# Altium schematic sheet PSU.SchDoc
size 420 x 297 mm; Address1: Address1; Address2: Address2; Address3: Address3; Address4: Address4; SheetNumber: 2; SheetTotal: 2; DocumentType: Схема электрическая принципиальная
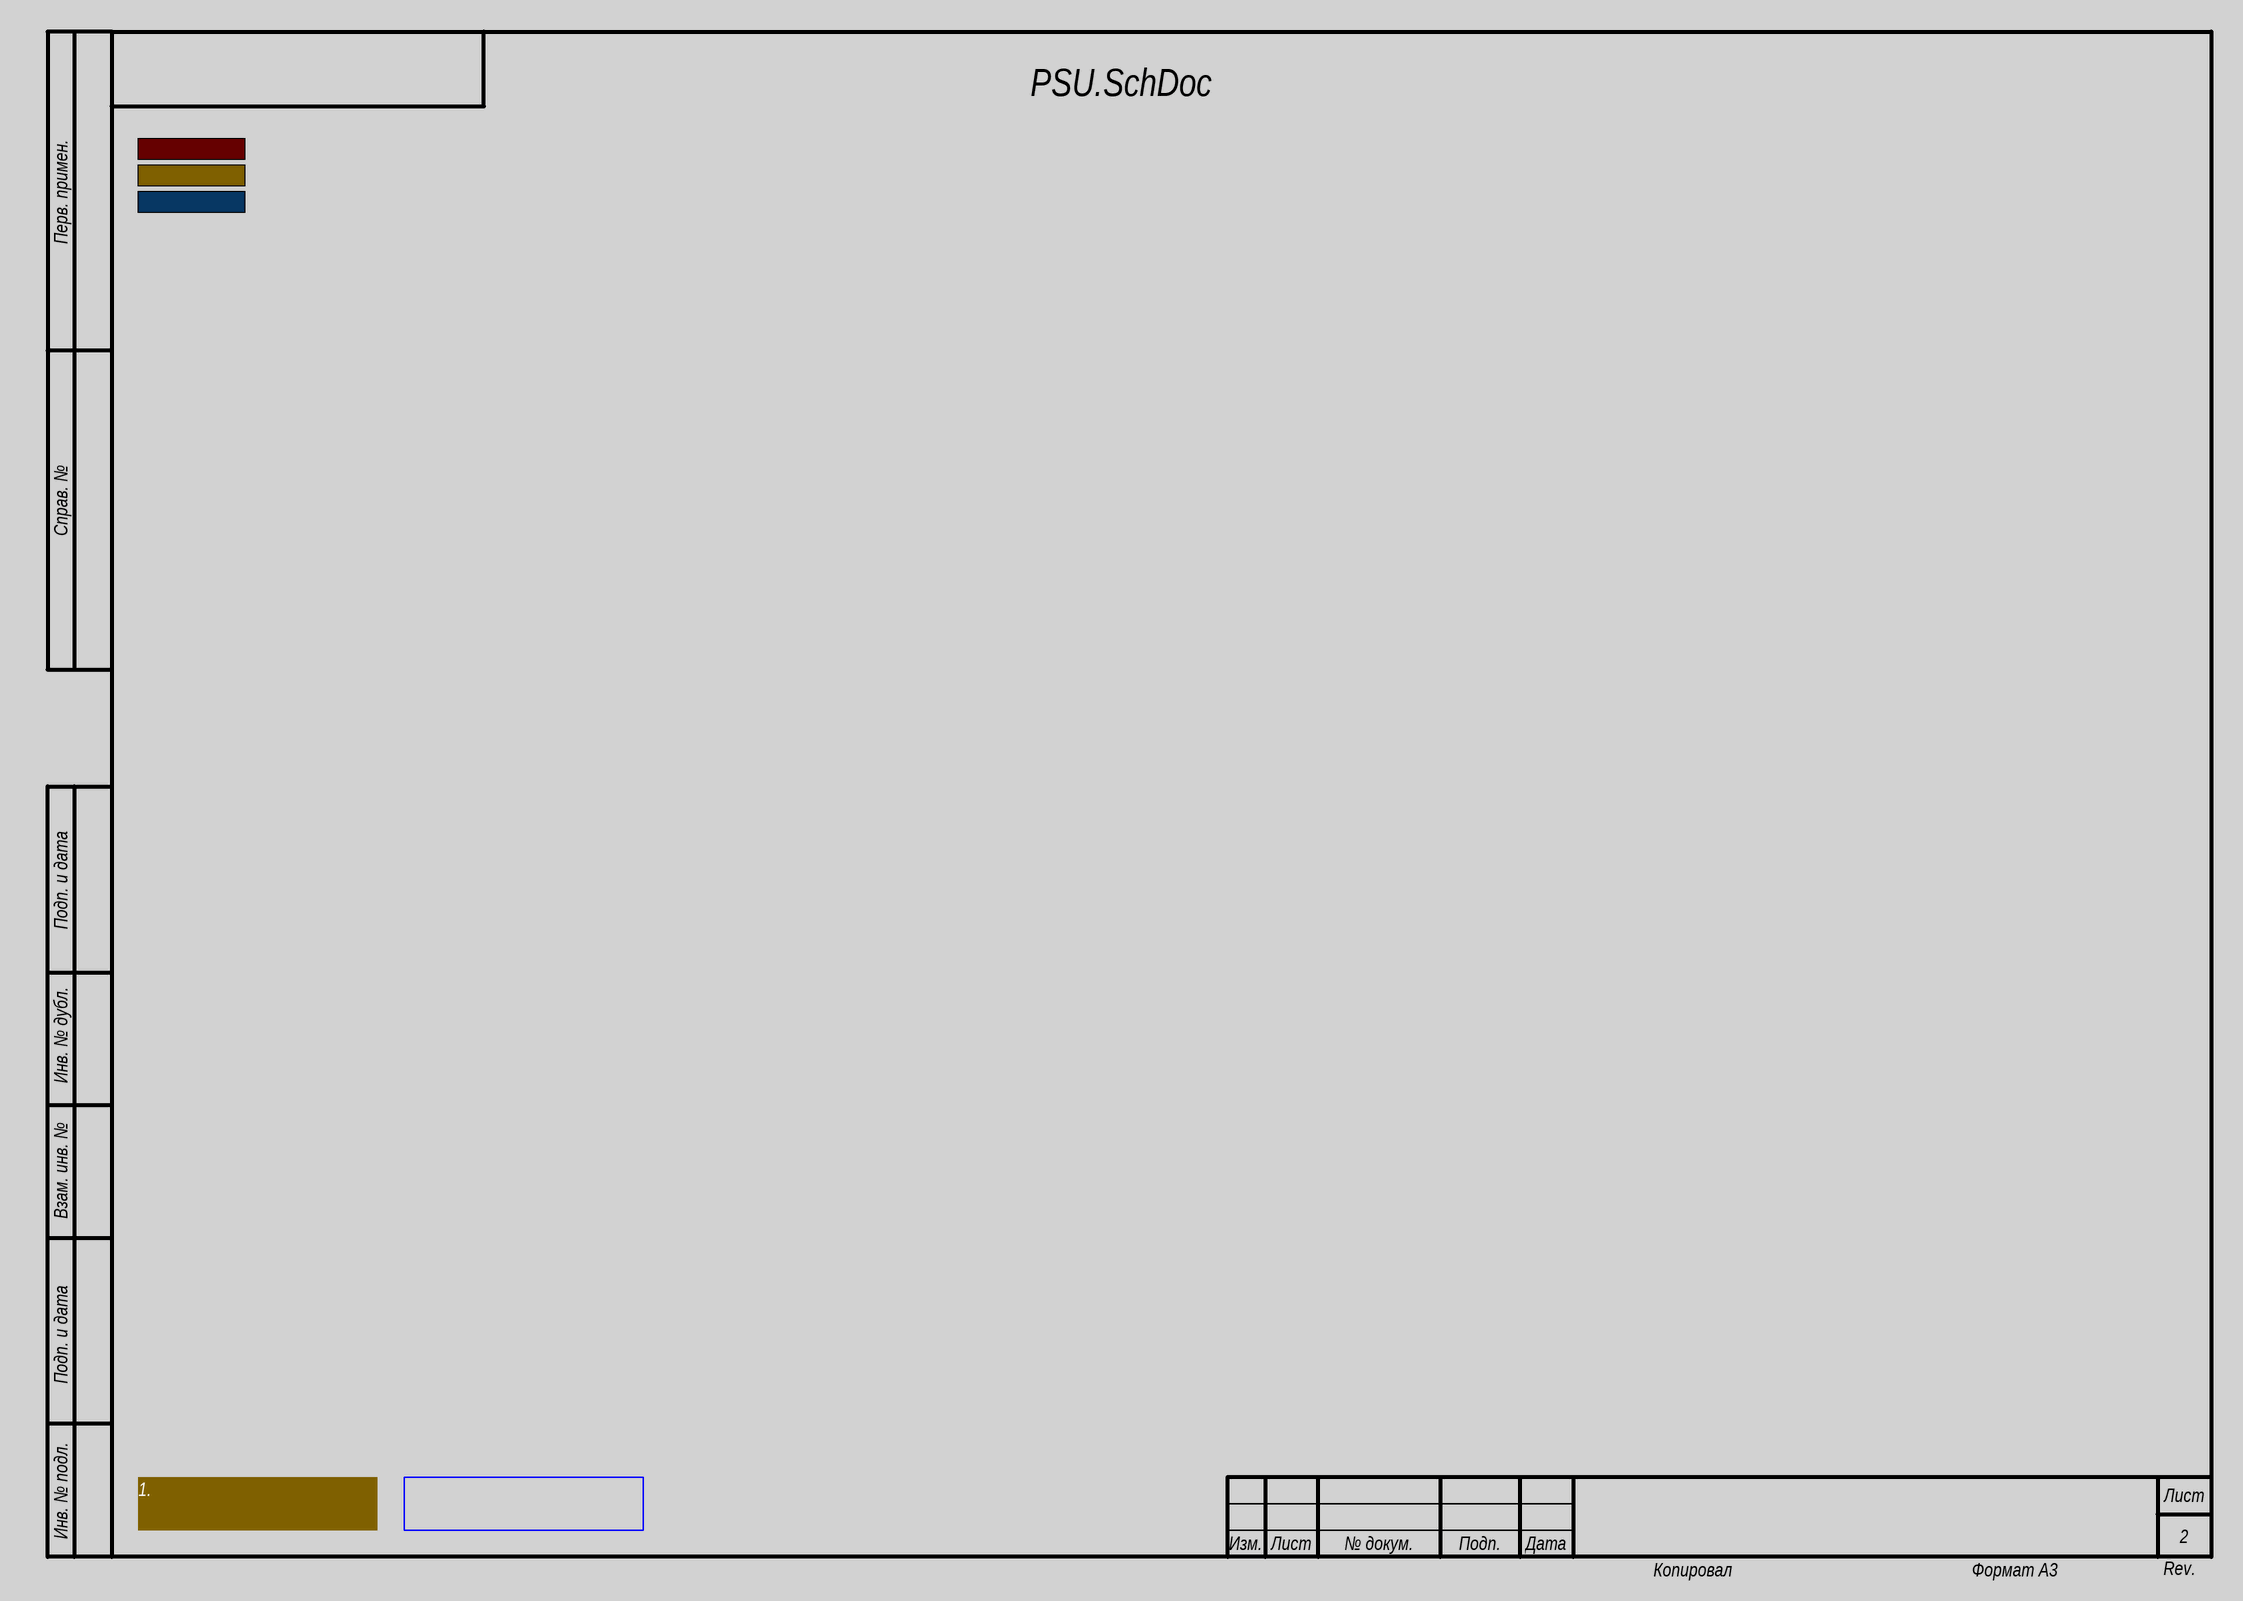
[diagram p0: PSU.SchDoc]

## Ports
 (in, see Main[1B], Current Sensing Main[1C], PSU Backup[1B], PSU Main[1B], Switch Backup[1A]),  (in, see Main[2B], Current Sensing Main[4A]),  (in, see Main[2B], Current Sensing Main[4A], PSU Backup[4B], PSU Control[4A], PSU Main[4B], Switch Backup[1A], Switch Main[1A])

## Notes on the sheet
- 1.
- Rev.
- Перв. примен.
- Справ. №
- Подп. и дата
- Инв. № дубл.
- Взам. инв. №
- Инв. № подл.
- Изм.
- Лист
- № докум.
- Подп.
- Дата
- Копировал
- Формат А3